# EAGLE design esc_control (EAGLE 9.6.2)
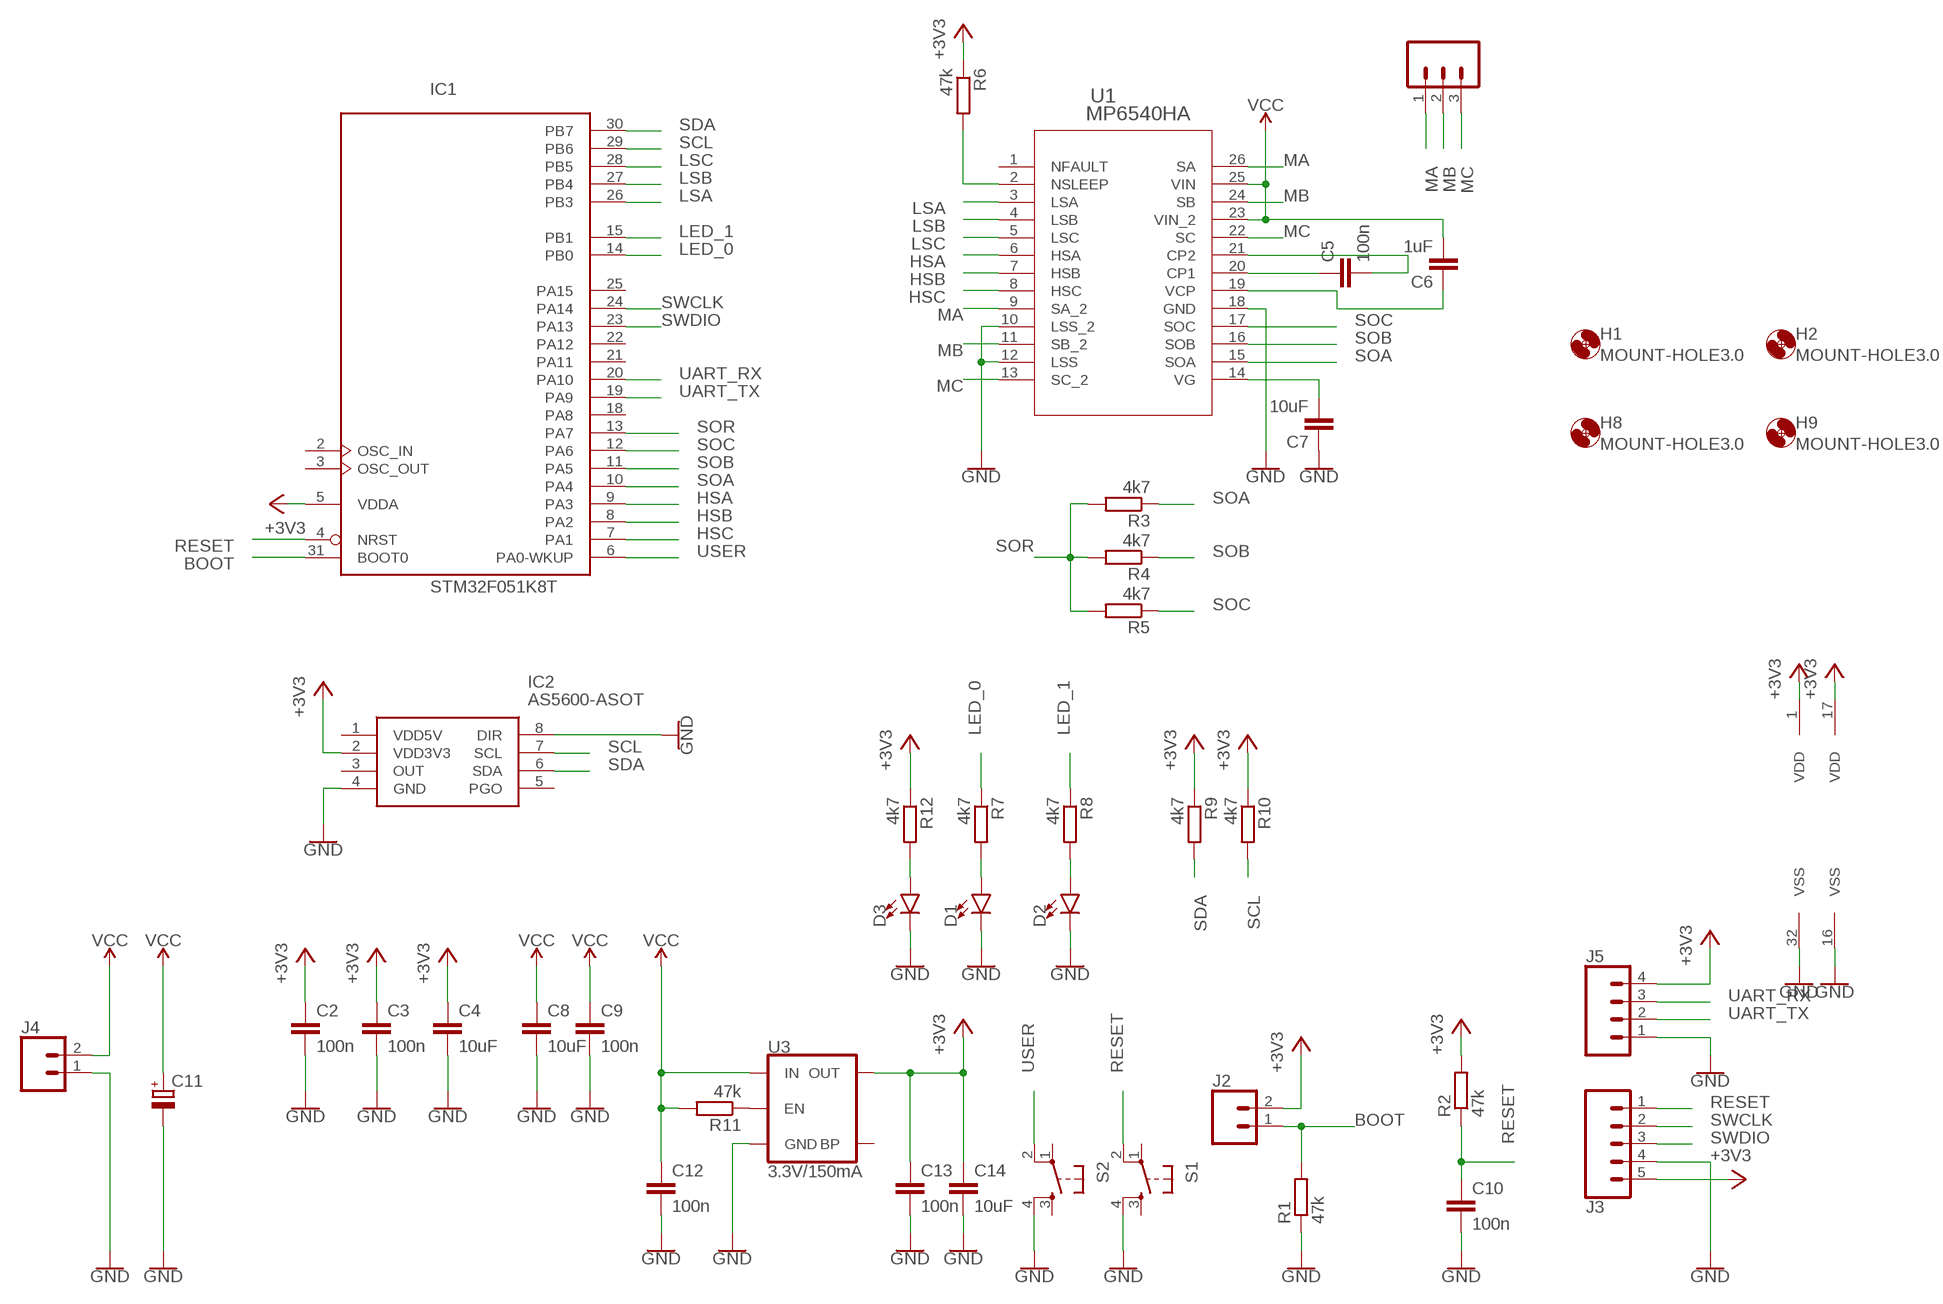
[diagram p0: schematic, sheet 1]

## Parts
C2  100n  C-EUC0805  [C0805]
C3  100n  C-EUC0805  [C0805]
C4  10uF  C-EUC0805  [C0805]
C5  100n  C-EUC0805  [C0805]
C6  1uF  C-EUC0805  [C0805]
C7  10uF  C-EUC0805  [C0805]
C8  10uF  C-EUC0805  [C0805]
C9  100n  C-EUC0805  [C0805]
C10  100n  C-EUC0805  [C0805]
C11  CPOL-EU153CLV-0605  [153CLV-0605]
C12  100n  C-EUC0805  [C0805]
C13  100n  C-EUC0805  [C0805]
C14  10uF  C-EUC0805  [C0805]
D1  LED1206  [LED-1206]
D2  LED1206  [LED-1206]
D3  LED1206  [LED-1206]
H1  MOUNT-HOLE3.0  [3,0]
H2  MOUNT-HOLE3.0  [3,0]
H8  MOUNT-HOLE3.0  [3,0]
H9  MOUNT-HOLE3.0  [3,0]
IC1  STM32F051K8T  [LQFP32]
IC2  AS5600-ASOT  [SOIC127P600X175-8N]
J1  455-1750-1-ND  CONN_03  [1X03]
J2  CONN_02PTH3  [1X02_LONGPADS]
J3  CONN_05PTH_LONGPADS  [1X05_LONGPADS]
J4  CONN_02PTH3  [1X02_LONGPADS]
J5  CONN_04LONGPADS  [1X04_LONGPADS]
R1  47k  R-EU_M0805  [M0805]
R2  47k  R-EU_M0805  [M0805]
R3  4k7  R-EU_M0805  [M0805]
R4  4k7  R-EU_M0805  [M0805]
R5  4k7  R-EU_M0805  [M0805]
R6  47k  R-EU_M0805  [M0805]
R7  4k7  R-EU_M0805  [M0805]
R8  4k7  R-EU_M0805  [M0805]
R9  4k7  R-EU_M0805  [M0805]
R10  4k7  R-EU_M0805  [M0805]
R11  47k  R-EU_M0805  [M0805]
R12  4k7  R-EU_M0805  [M0805]
S1  TAC_SWITCHSMD  [TACTILE-SWITCH-SMD]
S2  TAC_SWITCHSMD  [TACTILE-SWITCH-SMD]
U1  MP6540HA  [QFN-5X5_MP6540HA_MNP]
U3  3.3V/150mA  V_REG_MIC52053.3V  [SOT23-5]

## Nets
+3V3: C2.1 C3.1 C4.1 C13.1 C14.1 IC1.1(VDD) IC1.5(VDDA) IC1.17(VDD) IC2.2(VDD3V3) J2.2 J3.5 J5.4 R2.2 R6.1 R9.1 R10.1 R12.1 U3.5(OUT)
BOOT: IC1.31(BOOT0) J2.1 R1.2
GND: C2.2 C3.2 C4.2 C7.1 C8.2 C9.2 C10.2 C11.- C12.2 C13.2 C14.2 D1.C D2.C D3.C IC1.16(VSS) IC1.32(VSS) IC2.4(GND) IC2.8(DIR) J3.4 J4.1 J5.1 R1.1 S1.4 S2.4 U1.10(LSS_2) U1.12(LSS) U1.18(GND) U3.2(GND)
HSA: IC1.9(PA3) U1.6(HSA)
HSB: IC1.8(PA2) U1.7(HSB)
HSC: IC1.7(PA1) U1.8(HSC)
LED_0: IC1.14(PB0) R7.1
LED_1: IC1.15(PB1) R8.1
LSA: IC1.26(PB3) U1.3(LSA)
LSB: IC1.27(PB4) U1.4(LSB)
LSC: IC1.28(PB5) U1.5(LSC)
MA: J1.1 U1.9(SA_2) U1.26(SA)
MB: J1.2 U1.11(SB_2) U1.24(SB)
MC: J1.3 U1.13(SC_2) U1.22(SC)
N$1: C5.1 U1.20(CP1)
N$2: C5.2 U1.21(CP2)
N$3: C6.1 U1.19(VCP)
N$4: R6.2 U1.2(NSLEEP)
N$5: C7.2 U1.14(VG)
N$6: D1.A R7.2
N$7: D2.A R8.2
N$8: R11.1 U3.3(EN)
N$9: D3.A R12.2
RESET: C10.1 IC1.4(NRST) J3.1 R2.1 S1.2
SCL: IC1.29(PB6) IC2.7(SCL) R10.2
SDA: IC1.30(PB7) IC2.6(SDA) R9.2
SOA: IC1.10(PA4) R3.1 U1.15(SOA)
SOB: IC1.11(PA5) R4.1 U1.16(SOB)
SOC: IC1.12(PA6) R5.1 U1.17(SOC)
SOR: IC1.13(PA7) R3.2 R4.2 R5.2
SWCLK: IC1.24(PA14) J3.2
SWDIO: IC1.23(PA13) J3.3
UART_RX: IC1.20(PA10) J5.3
UART_TX: IC1.19(PA9) J5.2
USER: IC1.6(PA0-WKUP) S2.2
VCC: C6.2 C8.1 C9.1 C11.+ C12.1 J4.2 R11.2 U1.23(VIN_2) U1.25(VIN) U3.1(IN)
Unconnected: IC1.2(OSC_IN) IC1.3(OSC_OUT) IC1.18(PA8) IC1.21(PA11) IC1.22(PA12) IC1.25(PA15) IC2.1(VDD5V) IC2.3(OUT) IC2.5(PGO) S1.1 S1.3 S2.1 S2.3 U1.1(NFAULT) U3.4(BP)

## Library data of the parts
C2-C10 C12-C14 = rcl:C-EU: CAPACITOR, European symbol; SPICEPREFIX: C
C11 = rcl:CPOL-EU: POLARIZED CAPACITOR, European symbol; SPICEPREFIX: C
D1-D3 = SparkFun-LED:LED: LED (Generic) Standard schematic elements and footprints for 5mm, 3mm, 1206, and 0603 sized LEDs. Generic LEDs with no color specified.
H1 H2 H8 H9 = holes:MOUNT-HOLE: MOUNTING HOLE with drill center marker
IC1 = micro-stm_v3:STM32F051K*T: ARM 32-bit Cortex™-M0 CPU 48 MHz maximum frequency 16 to 32 Kbytes of Flash memory 4 kbytes of SRAM 25 GPIOs 2.0 to 3.6 V application supply
IC2 = AS5600:AS5600-ASOT: Board Mount Hall Effect / Magnetic Sensors AS5600 Magnetic Sensor 12-Bit Source: Datasheet <http://www.ams.com/eng/content/download/639463/1698857/325295>; DESCRIPTION: Board Mount Hall Effect / Magnetic Sensors AS5600 Magnetic Sensor 12-Bit; HEIGHT: 1.75mm; MANUFACTURER_NAME: ams; MANUFACTURER_PART_NUMBER: AS5600-ASOT; MOUSER_PART_NUMBER: 985-AS5600-ASOT; MOUSER_PRICE-STOCK: https://www.mouser.com/Search/Refine.aspx?Keyword=985-AS5600-ASOT
J1 = SparkFun-Connectors:CONN_03: Multi connection point. Often used as Generic Header-pin footprint for 0.1 inch spaced/style header connections On any of the 0.1 inch spaced packages, you can populate with these: Break Away Headers - Straight <https://www.sparkfun.com/products/116> (PRT-00116) Break Away Male Headers - Right Angle <https://www.sparkfun.com/products/553> (PRT-00553) Female Headers <https://www.sparkfun.com/products/115> (PRT-00115) Break Away Headers - Machine Pin <https://www.sparkfun.com/products/117> (PRT-00117) Break Away Female Headers - Swiss Machine Pin <https://www.sparkfun.com/products/743> (PRT-00743) Stackable Header - 3 Pin (Female, 0.1") <https://www.sparkfun.com/products/13875> (PRT-13875) For SCREWTERMINALS and SPRING TERMINALS visit here: Screw Terimnals on SparkFun.com <https://www.sparkfun.com/search/results?term=Screw+Terminals> (5mm/3.5mm/2.54mm spacing) This device is also useful as a general connection point to wire up your design to another part of your project. Our various solder wires solder well into these plated through hole pads. Hook-Up Wire - Assortment (Stranded, 22 AWG) <https://www.sparkfun.com/products/11375> (PRT-11375) Hook-Up Wire - Assortment (Solid Core, 22 AWG) <https://www.sparkfun.com/products/11367> (PRT-11367) View the entire wire category on our website here <https://www.sparkfun.com/categories/141> Special notes: Molex polarized connector foot print use with SKU : PRT-08232 with associated crimp pins and housings.; PROD_ID: XXX-00000
J2 J4 = SparkFun-Connectors:CONN_02: Multi connection point. Often used as Generic Header-pin footprint for 0.1 inch spaced/style header connections On any of the 0.1 inch spaced packages, you can populate with these: Break Away Headers - Straight <https://www.sparkfun.com/products/116> (PRT-00116) Break Away Male Headers - Right Angle <https://www.sparkfun.com/products/553> (PRT-00553) Female Headers <https://www.sparkfun.com/products/115> (PRT-00115) Break Away Headers - Machine Pin <https://www.sparkfun.com/products/117> (PRT-00117) Break Away Female Headers - Swiss Machine Pin <https://www.sparkfun.com/products/743> (PRT-00743) For SCREWTERMINALS and SPRING TERMINALS visit here: Screw Terimnals on SparkFun.com <https://www.sparkfun.com/search/results?term=Screw+Terminals> (5mm/3.5mm/2.54mm spacing) This device is also useful as a general connection point to wire up your design to another part of your project. Our various solder wires solder well into these plated through hole pads. Hook-Up Wire - Assortment (Stranded, 22 AWG) <https://www.sparkfun.com/products/11375> (PRT-11375) Hook-Up Wire - Assortment (Solid Core, 22 AWG) <https://www.sparkfun.com/products/11367> (PRT-11367) View the entire wire category on our website here <https://www.sparkfun.com/categories/141> Special notes: Molex polarized connector foot print use with: PRT-08233 with associated crimp pins and housings. 2.54_SCREWTERM for use with PRT-10571. 3.5mm Screw Terminal footprints for PRT-08084 5mm Screw Terminal footprints for use with PRT-08432
J3 = SparkFun-Connectors:CONN_05: Multi connection point. Often used as Generic Header-pin footprint for 0.1 inch spaced/style header connections On any of the 0.1 inch spaced packages, you can populate with these: Break Away Headers - Straight <https://www.sparkfun.com/products/116> (PRT-00116) Break Away Male Headers - Right Angle <https://www.sparkfun.com/products/553> (PRT-00553) Female Headers <https://www.sparkfun.com/products/115> (PRT-00115) Break Away Headers - Machine Pin <https://www.sparkfun.com/products/117> (PRT-00117) Break Away Female Headers - Swiss Machine Pin <https://www.sparkfun.com/products/743> (PRT-00743) For SCREWTERMINALS and SPRING TERMINALS visit here: Screw Terimnals on SparkFun.com <https://www.sparkfun.com/search/results?term=Screw+Terminals> (5mm/3.5mm/2.54mm spacing) This device is also useful as a general connection point to wire up your design to another part of your project. Our various solder wires solder well into these plated through hole pads. Hook-Up Wire - Assortment (Stranded, 22 AWG) <https://www.sparkfun.com/products/11375> (PRT-11375) Hook-Up Wire - Assortment (Solid Core, 22 AWG) <https://www.sparkfun.com/products/11367> (PRT-11367) View the entire wire category on our website here <https://www.sparkfun.com/categories/141> Special notes: Molex polarized connector foot print use with SKU : PRT-08231 with associated crimp pins and housings. 1MM SMD Version SKU: PRT-10208
J5 = SparkFun-Connectors:CONN_04: Multi connection point. Often used as Generic Header-pin footprint for 0.1 inch spaced/style header connections On any of the 0.1 inch spaced packages, you can populate with these: Break Away Headers - Straight <https://www.sparkfun.com/products/116> (PRT-00116) Break Away Male Headers - Right Angle <https://www.sparkfun.com/products/553> (PRT-00553) Female Headers <https://www.sparkfun.com/products/115> (PRT-00115) Break Away Headers - Machine Pin <https://www.sparkfun.com/products/117> (PRT-00117) Break Away Female Headers - Swiss Machine Pin <https://www.sparkfun.com/products/743> (PRT-00743) For SCREWTERMINALS and SPRING TERMINALS visit here: Screw Terimnals on SparkFun.com <https://www.sparkfun.com/search/results?term=Screw+Terminals> (5mm/3.5mm/2.54mm spacing) This device is also useful as a general connection point to wire up your design to another part of your project. Our various solder wires solder well into these plated through hole pads. Hook-Up Wire - Assortment (Stranded, 22 AWG) <https://www.sparkfun.com/products/11375> (PRT-11375) Hook-Up Wire - Assortment (Solid Core, 22 AWG) <https://www.sparkfun.com/products/11367> (PRT-11367) View the entire wire category on our website here <https://www.sparkfun.com/categories/141> Special notes: Molex polarized connector foot print use with SKU : PRT-08231 with associated crimp pins and housings. 1MM SMD Version SKU: PRT-10208; PROD_ID: CONN-09696
R1-R12 = rcl:R-EU_: RESISTOR, European symbol; SPICEPREFIX: R
S1 S2 = SparkFun-Retired:TAC_SWITCH: Momentary Switch Button commonly used for reset or general input. Spark Fun Electronics SKU : COM-00097 SMT- SWCH-08247; PROD_ID: SWCH-08247
U1 = my_library:MP6540HA; BUILT_BY: EMA_Justin; COPYRIGHT: Copyright (C) 2018 Accelerated Designs. All rights reserved; DATASHEET: https://www.monolithicpower.com/en/documentview/productdocument/index/version/2/document_type/Datasheet/lang/en/sku/MP6540HA/document_id/6884/; MANUFACTURER_PART_NUMBER: MP6540HA; SOURCELIBRARY: Monolithic_Power_Systems_2020-10-09; VENDOR: Monolithic Power Systems Inc
U3 = SparkFun-IC-Power:V_REG_MIC5205: V_REG MIC5205 Standard 3.3V, 5V, and Adjustable 150mA LDO voltage regulator in SOT-23 layout. Micrel part MIC5205. BP (by-pass) pin is used to lower output noise with 470pF cap, may be left open. On the adjustable version BP is used to set output.; PROD_ID: VREG-00822

## Board
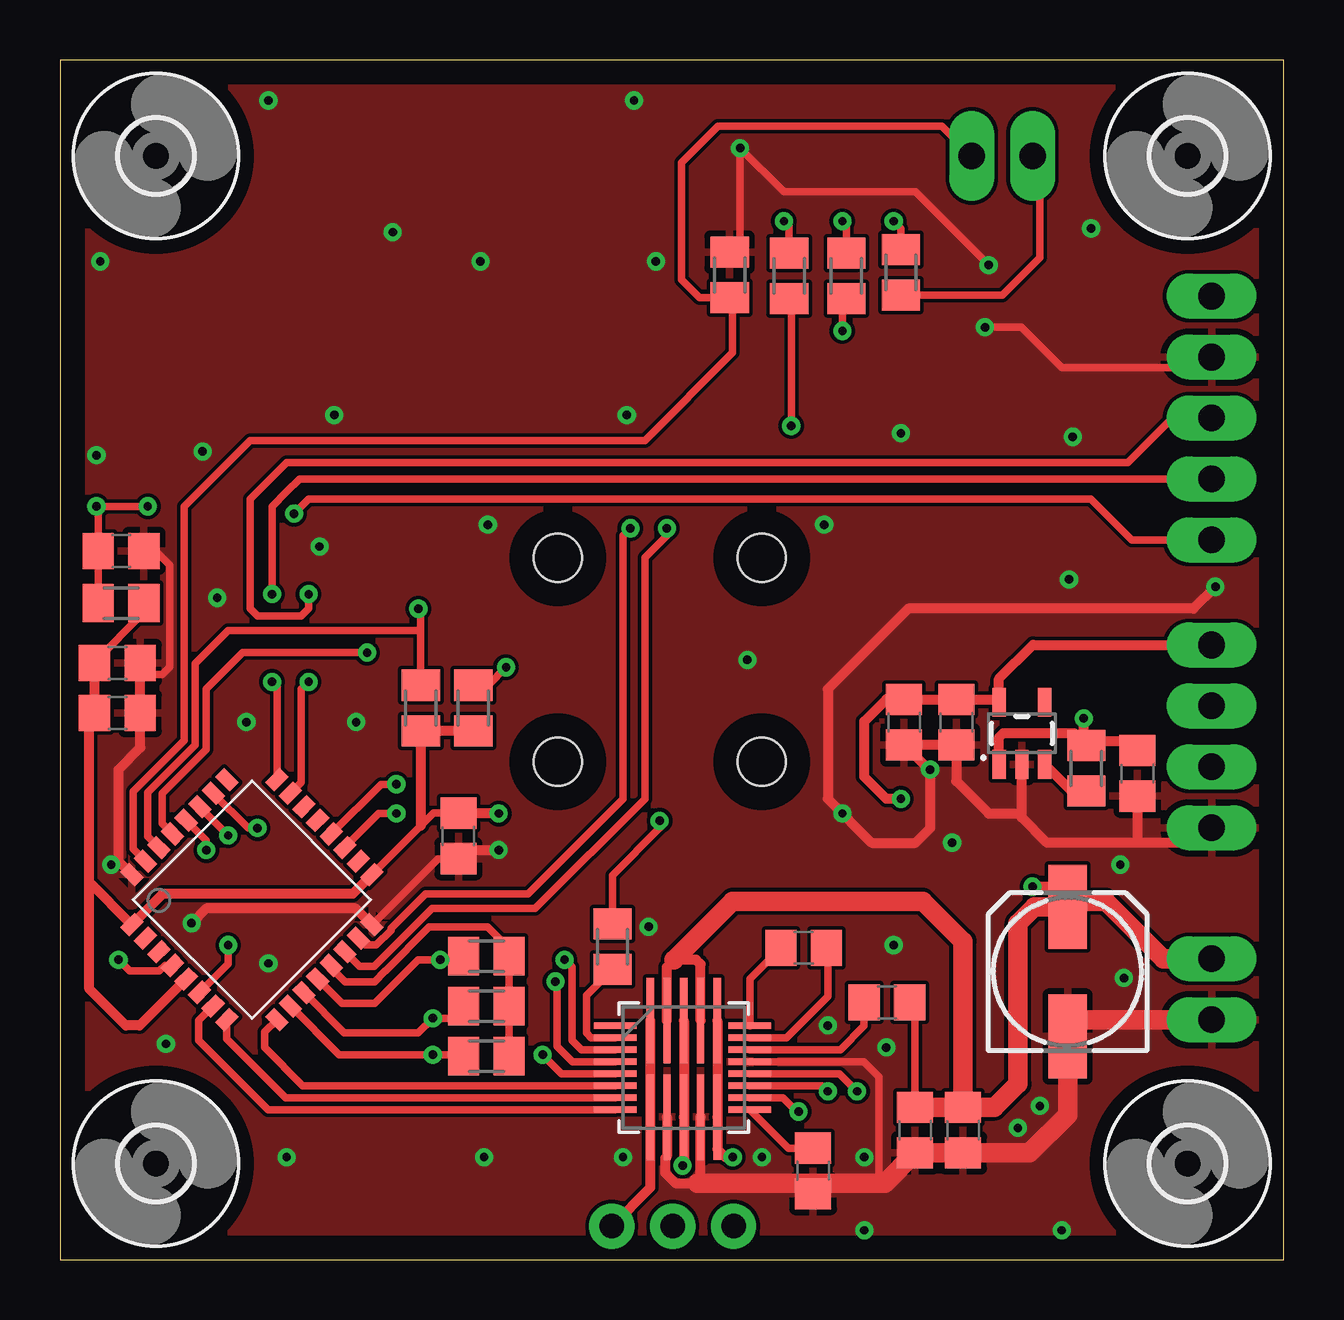
[diagram p1: board, top side]
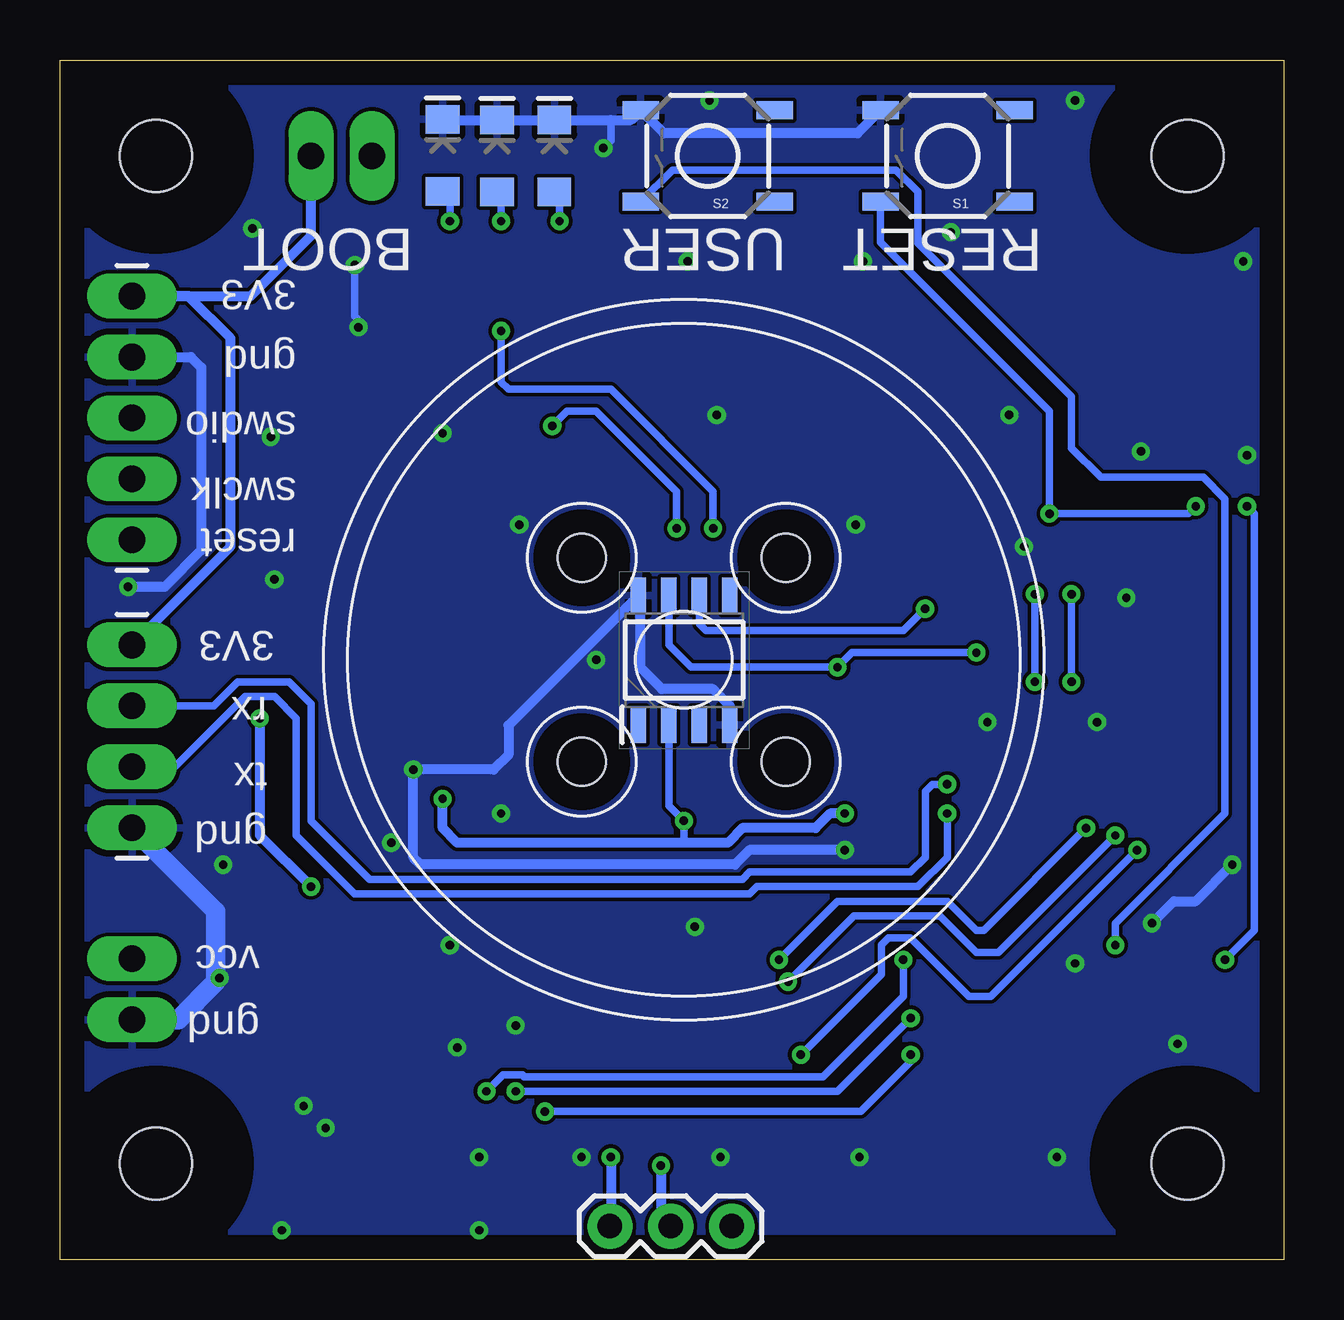
[diagram p2: board, bottom side, seen from below]

Size 51 x 50 mm. Coordinates in mm from the lower left corner, seen from the top.
Outline: 0,0 51,0 51,50 0,50 0,0
Copper layers (1*16): Top 0.035mm / dielectric 1.5mm / Bottom 0.035mm
Design rules "default": minimum track width 6mil, minimum drill 0.35mm, track to track 6mil, track to pad 6mil, pad to pad 6mil, via to via 6mil, smd to smd 6mil, copper to edge 40mil, drill to drill 6mil, minimum pad ring 10mil, minimum via ring 8mil, stop-mask expansion 4mil, vias tented up to drill 0mil, thermal gap 10mil

### Footprints (pad centres in the part's own frame; a part is rotated, then mirrored left to right if it is on the bottom)
C0805 = smd 1.3 x 1.5: 1 -0.95,0; 2 0.95,0
153CLV-0605 = smd 3.5 x 1.6: + 2.7,0; - -2.7,0
LED-1206 = smd 1.2 x 1.4: A -1.5,0; C 1.5,0
3,0 = hole 3: 0,0
LQFP32 = smd 0.54 x 0.85: 1 -2.8,-4.275; 2 -2,-4.275; 3 -1.2,-4.275; 4 -0.4,-4.275; 5 0.4,-4.275; 6 1.19,-4.275; 7 1.99,-4.275; 8 2.79,-4.275; 17 2.8,4.275; 18 2,4.275; 19 1.2,4.275; 20 0.4,4.275; 21 -0.4,4.275; 22 -1.2,4.275; 23 -2,4.275; 24 -2.8,4.275 | smd 0.85 x 0.54: 9 4.275,-2.8; 10 4.275,-2; 11 4.275,-1.2; 12 4.275,-0.4; 13 4.275,0.4; 14 4.275,1.2; 15 4.275,2; 16 4.275,2.8; 25 -4.275,2.8; 26 -4.275,2; 27 -4.275,1.2; 28 -4.275,0.4; 29 -4.275,-0.4; 30 -4.275,-1.2; 31 -4.275,-2; 32 -4.275,-2.8
SOIC127P600X175-8N = smd 1.5 x 0.65: 1 -2.7,1.905; 2 -2.7,0.635; 3 -2.7,-0.635; 4 -2.7,-1.905; 5 2.7,-1.905; 6 2.7,-0.635; 7 2.7,0.635; 8 2.7,1.905
1X03 = drill 1.016 pad 1.88: 1 0,0; 2 2.54,0; 3 5.08,0
1X02_LONGPADS = drill 1.118 pad 1.88 long: 1 0,0; 2 2.54,0
1X05_LONGPADS = drill 1.118 pad 1.88 long: 1 0,0; 2 2.54,0; 3 5.08,0; 4 7.62,0; 5 10.16,0
1X04_LONGPADS = drill 1.118 pad 1.88 long: 1 0,0; 2 2.54,0; 3 5.08,0; 4 7.62,0
M0805 = smd 1.3 x 1.6: 1 -0.95,0; 2 0.95,0
TACTILE-SWITCH-SMD = smd 1.524 x 0.762: 1 -2.794,1.905; 2 2.794,1.905; 3 -2.794,-1.905; 4 2.794,-1.905
QFN-5X5_MP6540HA_MNP = smd 1.778 x 0.254: 1 -2.858,1.75; 2 -2.858,1.25; 3 -2.858,0.75; 4 -2.858,0.25; 5 -2.858,-0.25; 6 -2.858,-0.75; 7 -2.858,-1.25; 8 -2.858,-1.75; 14 2.756,-1.75; 15 2.756,-1.25; 16 2.756,-0.75; 17 2.756,-0.25; 18 2.756,0.25; 19 2.756,0.75; 20 2.756,1.25; 21 2.756,1.75 | smd 0.305 x 3.556: 9 -1.4,-2.058; 10 -0.7,-2.058; 11 0,-2.058; 12 0.7,-2.058; 13 1.4,-2.058; 22 1.4,1.956; 23 0.7,1.956; 24 0,1.956; 25 -0.7,1.956; 26 -1.4,1.956
SOT23-5 = smd 0.55 x 1.2: 1 -0.95,-1.3; 2 0,-1.3; 3 0.95,-1.3; 4 0.95,1.3; 5 -0.95,1.3
BRUSHLESS_GIMBAL_MOTOR_2204 = hole 2: 4.25,4.25; -4.25,4.25; -4.25,-4.25; 4.25,-4.25

### Placement (x,y rotation side)
C2  2.39,24.87 0 top
C3  16.61,17.66 270 top
C4  2.39,22.78 0 top
C5  31,13 180 top
C6  34.47,10.72 0 top
C7  31.39,3.7 90 top
C8  35.64,5.39 270 top
C9  37.64,5.39 270 top
C10  2.55,29.53 0 top
C11  42,12 90 top
C12  44.91,20.26 270 top
C13  35.18,22.4 270 top
C14  37.36,22.4 270 top
D1  30.39,46 90 bottom
D2  32.78,46 90 bottom
D3  35.05,46.02 90 bottom
H1  47,4 0 top
H2  47,46 0 top
H8  4,4 0 top
H9  4,46 0 top
IC1  8,15 315 top
IC2  24.99,24.99 90 bottom
J1  23,1.39 180 bottom
J2  38,46 180 bottom
J3  48,30 90 bottom
J4  48,10 90 bottom
J5  48,18 90 bottom
R1  27.91,41.04 270 top
R2  2.55,27.36 0 top
R3  17.77,8.48 0 top
R4  17.77,10.56 0 top
R5  17.77,12.65 0 top
R6  23.03,13.04 270 top
R7  30.39,41 90 top
R8  32.78,41 90 top
R9  15.04,22.99 90 top
R10  17.22,22.99 90 top
R11  42.78,20.48 90 top
R12  35.05,41.15 90 top
S1  14,46 180 bottom
S2  24,46 180 bottom
U1  26,8 0 top
U3  40.09,21.93 0 top
U$1  [BRUSHLESS_GIMBAL_MOTOR_2204]  25,25 0 bottom

### Tracks (layer width: path | path; a pad name or v marks a point on that pad's centre or on a via)
+3V3  (via drill 0.35)
  Top 0.305: C3.1 15.57,18.61 15.04,18.08 IC1.17 | 22.86,14.16 R6.1 23.03,16.02 24.99,17.98 v24.99,18.29 | C2.1 1.44,24.91 3.5,26.97 R2.2 | R12.1 39.28,40.2 40.84,41.76 40.84,45.7 J2.2
  Top 0.406: J5.4 40.55,25.62 39.14,24.21 U3.5 39.03,23.35 C14.1 C13.1 34.44,23.35 33.53,22.43 33.53,20.12 34.44,19.2 v35.05,19.2 | 1.22,15.73 IC1.1 4.28,15.24 12.2,15.24 IC1.17 | 1.22,15.73 1.22,22.56 C4.1 C2.1 | IC1.5 3.32,9.75 2.74,9.75 1.22,11.28 1.22,15.73 | R10.1 R9.1 15.04,18.08 | C3.1 18.27,18.61 v18.29,18.59
  Bottom 0.305: 24.99,17.37 v24.99,18.29 25.62,18.92 IC2.2
  Bottom 0.406: v18.29,18.59 18.9,18.59 19.51,17.98 22.55,17.98 23.16,17.37 24.99,17.37 34.44,17.37 35.05,17.98 v35.05,19.2 | J2.2 40.54,42.67 43.05,40.16 J3.5 45.65,40.16 43.89,38.41 43.89,29.73 J5.4
BOOT
  Top 0.305: IC1.31 3.05,17.12 3.05,19.51 5.18,21.64 5.18,31.39 7.92,34.14 24.38,34.14 28.04,37.8 28.04,39.96 R1.2 26.66,40.09 25.91,40.84 25.91,45.72 27.43,47.24 36.76,47.24 J2.1
GND  (via drill 0.35)
  Top 0.305: C7.1 31.39,3.18 | 33.83,3.18 34.14,3.49 34.14,7.62 33.51,8.25 U1.18 | IC1.16 15.75,16.71 C3.2 | C10.2 3.99,29.53 4.57,28.96 4.57,24.69 4.27,24.38 3.34,24.38 | R1.1 28.35,42.42 v28.35,46.33 30.18,44.5 35.66,44.5 v38.71,41.45 | v38.56,38.86 40.08,38.86 41.76,37.19 47.57,37.19 J3.4
  Top 0.406: U1.10 25.3,4.3 25.22,4.22 25.22,3.61 25.65,3.18 26.56,3.18 26.69,3.31 26.69,5.93 U1.12 | C9.2 C8.2 | J5.1 47.37,17.37 44.81,17.37 | 44.81,17.37 41.14,17.37 40.09,18.42 40.09,18.59 | 40.09,18.59 U3.2 | 40.09,18.59 38.71,18.59 37.36,19.94 C14.2 C13.2 36.21,20.42 | C12.2 44.91,17.48 44.81,17.37 | IC1.32 2.44,16.6 2.44,16.76 | 2.44,16.76 2.44,20.42 3.35,21.34 3.35,22.77 C4.2 3.34,24.38 C2.2 | IC1.16 12.33,14.63 6.1,14.63 v5.49,14.02 | v2.13,16.46 2.44,16.76 | 36.21,20.42 v36.27,20.42 | C3.2 16.97,17.07 v18.29,17.07 | v48.16,28.04 47.24,27.13 35.36,27.13 32,23.77 32,19.2 33.83,17.37 35.66,17.37 36.27,17.98 36.27,20.36 36.21,20.42
  Top 0.813: 26.56,3.18 31.39,3.18 33.83,3.18 34.38,3.18 C8.2 40.41,4.44 42,6.03 C11.- 42.7,10 J4.1
  Bottom 0.305: v28.35,46.33 28.04,46.63 28.04,47.5 | v38.71,41.45 38.71,39.32 38.41,39.01 v38.56,38.86
  Bottom 0.406: v5.49,14.02 4.57,14.94 3.66,14.94 v2.13,16.46 | IC2.4 23.08,23.08 23.77,23.77 25.91,23.77 26.82,24.69 26.82,27.62 IC2.8 32.31,22.27 32.31,21.03 32.92,20.42 v36.27,20.42 36.27,16.76 35.97,16.46 22.86,16.46 22.25,17.07 v18.29,17.07 | D3.C 35.03,47.5 D2.C D1.C 28.04,47.5 27.2,47.5 S2.4 25.83,46.94 17.76,46.94 S1.4 | J3.4 45.55,37.62 45.11,37.19 45.11,29.57 46.63,28.04 v48.16,28.04
  Bottom 0.813: J5.1 44.5,14.5 44.5,11.58 46.08,10 J4.1
  other vias: 33.53,4.27 29.26,4.27 39.93,5.49 40.84,6.4 34.44,8.84 32,9.75 34.75,13.11 23.47,4.27 33.53,1.22 41.76,1.22 44.2,16.46 17.68,4.27 9.45,4.27 37.19,17.37 42.21,34.29 23.62,35.2 11.43,35.2 17.53,41.61 24.84,41.61 13.87,42.82 1.68,41.61 5.94,33.68 8.69,48.31 23.93,48.31 31.85,30.63 17.83,30.63 6.55,27.58 7.77,22.4 12.34,22.4 8.69,12.34 4.42,8.99 24.54,13.87 44.35,11.73 32.61,18.59 28.65,24.99 42.06,28.35 35.05,34.44 42.98,42.98 1.52,33.53 10.82,29.72
  pour Top: -0.61,50.6 51.51,50.6 51.51,-2.74 -0.61,-2.74
  pour Bottom: -0.3,51.82 75.29,51.82 75.29,-2.13 -0.3,-2.13
HSA
  Top 0.305: U1.6 10.12,7.25 8.53,8.84 8.53,9.49 IC1.9
HSB
  Top 0.305: U1.7 9.4,6.75 6.95,9.2 IC1.8
HSC
  Top 0.305: U1.8 8.69,6.25 5.79,9.14 5.79,9.98 IC1.7
LED_0  (via drill 0.35)
  Top 0.305: IC1.14 12.49,12.21 13.09,12.21 15.51,14.63 19.81,14.63 24.38,19.2 24.38,29.26 25.3,30.18 v25.3,30.48 | v30.48,34.75 30.48,39.96 R7.1
  Bottom 0.305: v25.3,30.48 25.3,32 28.65,35.36 29.87,35.36 v30.48,34.75
LED_1  (via drill 0.35)
  Top 0.305: IC1.15 12.72,13.11 13.18,13.11 13.8,13.72 13.8,13.8 15.24,15.24 19.51,15.24 23.47,19.2 23.47,30.18 v23.77,30.48 | v32.61,38.71 32.61,39.88 R8.1
  Bottom 0.305: v23.77,30.48 23.77,32 28.04,36.27 32.31,36.27 32.61,36.58 v32.61,38.71
LSA  (via drill 0.35)
  Top 0.305: U1.3 21.73,8.75 21.34,9.14 21.34,12.19 v21.03,12.5 | v8.23,17.98 7.84,17.98 IC1.26
  Bottom 0.305: v21.03,12.5 18.59,14.94 14.02,14.94 12.8,13.72 12.5,13.72 v8.23,17.98
LSB  (via drill 0.35)
  Top 0.305: U1.4 21.37,8.25 20.73,8.89 20.73,11.51 v20.65,11.58 | v7.01,17.68 IC1.27
  Bottom 0.305: v20.65,11.58 17.91,14.33 14.33,14.33 12.8,12.8 11.89,12.8 v7.01,17.68
LSC  (via drill 0.35)
  Top 0.305: U1.5 20.9,7.75 v20.12,8.53 | IC1.28 6.1,17.47 v6.1,17.07
  Bottom 0.305: v6.1,17.07 10.67,12.5 10.97,12.19 12.19,10.97 13.11,10.97 15.54,13.41 16.46,13.41 16.76,13.11 16.76,11.89 v20.12,8.53
MA
  Top 0.406: U1.26 U1.9 24.6,2.99 J1.1
MB  (via drill 0.35)
  Top 0.406: U1.24 U1.11 26,4.05 25.91,3.96 v25.95,3.92
  Bottom 0.406: v25.95,3.92 25.95,1.8 J1.2
MC  (via drill 0.35)
  Top 0.406: U1.22 U1.13 27.4,4.6 27.74,4.27 v28.04,4.27
  Bottom 0.406: v28.04,4.27 28.04,1.43 J1.3
N$1
  Top 0.305: U1.20 30.28,9.25 32,10.97 32,12.95 C5.1
N$2
  Top 0.305: U1.21 28.76,11.71 C5.2
N$3
  Top 0.305: U1.19 32.52,8.75 33.52,9.74 C6.1
N$4
  Top 0.305: U1.2 22.14,9.25 21.95,9.45 21.95,11.01 R6.2
N$5
  Top 0.305: U1.14 30.36,4.64 C7.2
N$6  (via drill 0.35)
  Top 0.305: R7.2 30.39,43.07 v30.18,43.28
  Bottom 0.305: v30.18,43.28 30.18,44.28 D1.A
N$7  (via drill 0.35)
  Top 0.305: R8.2 32.78,43.11 v32.61,43.28
  Bottom 0.305: v32.61,43.28 32.61,44.33 D2.A
N$8
  Top 0.406: U3.3 42.15,19.53 R11.1
N$9  (via drill 0.35)
  Top 0.305: R12.2 35.05,42.98 v34.75,43.28
  Bottom 0.305: v34.75,43.28 34.75,44.22 D3.A
RESET  (via drill 0.35)
  Top 0.305: J3.1 44.68,30 42.98,31.7 10.36,31.7 v9.75,31.09 | IC1.4 4.38,12.26 4.14,12.03 2.91,12.03 v2.44,12.5 | R2.1 C10.1 1.6,31.32 v1.52,31.39 v3.66,31.39
  Bottom 0.305: v2.44,12.5 1.22,13.72 1.22,31.09 v1.52,31.39 | v3.66,31.39 3.96,31.09 v9.75,31.09 9.75,35.36 16.79,42.4 S1.2
SCL  (via drill 0.35)
  Top 0.305: IC1.29 4.27,18.17 4.27,19.43 6.1,21.26 6.1,23.77 7.62,25.3 v12.8,25.3 | v18.59,24.69 17.84,23.94 R10.2
  Bottom 0.305: IC2.7 25.62,25.62 24.69,24.69 v18.59,24.69 17.98,25.3 v12.8,25.3
SDA  (via drill 0.35)
  Top 0.305: IC1.30 3.66,17.64 3.66,19.47 5.64,21.45 5.64,24.84 7.01,26.21 15.04,26.21 | v14.94,27.13 15.04,27.02 15.04,26.21 | 15.04,26.21 R9.2
  Bottom 0.305: IC2.6 24.35,26.49 24.08,26.21 23.16,26.21 15.85,26.21 v14.94,27.13
SOA  (via drill 0.35)
  Top 0.305: U1.15 30.13,6.75 30.79,6.1 v30.79,6.17 | R3.1 16.77,8.53 v15.54,8.53 11.64,8.53 IC1.10
  Bottom 0.305: v30.79,6.17 17.61,6.17 15.54,8.23 v15.54,8.53
SOB  (via drill 0.35)
  Top 0.305: U1.16 31.76,7.25 v32,7.01 | R4.1 16.32,10.06 v15.54,10.06 14.94,9.45 11.85,9.45 IC1.11
  Bottom 0.305: v32,7.01 18.59,7.01 v15.54,10.06
SOC  (via drill 0.35)
  Top 0.305: U1.17 32.48,7.75 v33.22,7.01 | R5.1 16.67,12.5 v15.85,12.5 14.94,12.5 13.11,10.67 11.77,10.67 IC1.12
  Bottom 0.305: v33.22,7.01 32.54,7.69 31.72,7.69 31.65,7.62 19.2,7.62 15.85,10.97 v15.85,12.5
SOR
  Top 0.305: 18.88,12.5 R5.2 | R5.2 R4.2 R3.2 | R5.2 18.72,12.97 17.83,13.87 15.39,13.87 13.56,12.04 13.55,12.03 13.11,11.58 11.89,11.58 11.31,12.16 IC1.13
SWCLK  (via drill 0.35)
  Top 0.305: IC1.24 9.04,23.88 v8.84,24.08 | v8.84,27.74 8.84,31.39 9.45,32 9.98,32.54 J3.2
  Bottom 0.305: v8.84,24.08 v8.84,27.74
SWDIO  (via drill 0.35)
  Top 0.305: IC1.23 10.06,19.89 10.06,23.77 v10.36,24.08 | J3.3 46.36,35.08 44.5,33.22 9.45,33.22 7.92,31.7 7.92,27.13 8.23,26.82 10.06,26.82 10.36,27.13 v10.36,27.74
  Bottom 0.305: v10.36,24.08 v10.36,27.74
UART_RX  (via drill 0.35)
  Top 0.305: IC1.20 13.38,19.81 v14.02,19.81
  Bottom 0.305: J5.3 44.59,23.08 43.59,24.08 41.45,24.08 40.54,23.16 40.54,18.29 39.01,16.76 38.71,16.46 38.1,15.85 22.55,15.85 22.25,16.15 15.54,16.15 14.94,16.76 14.94,19.51 14.63,19.81 v14.02,19.81
UART_TX  (via drill 0.35)
  Top 0.305: IC1.19 13.29,18.59 v14.02,18.59
  Bottom 0.305: J5.2 46.21,20.54 43.28,23.47 42.06,23.47 41.15,22.55 41.15,17.68 38.71,15.24 25.91,15.24 25.6,15.24 22.25,15.24 21.95,15.54 15.24,15.54 14.02,16.76 v14.02,18.59
USER  (via drill 0.35)
  Top 0.305: IC1.6 7.01,12.33 v7.01,13.11
  Bottom 0.305: v7.01,13.11 7.01,14.02 2.44,18.59 2.44,31.7 3.35,32.61 7.62,32.61 8.84,33.83 8.84,35.97 15.24,42.37 15.24,44.5 16.15,45.41 25.47,45.41 S2.2
VCC  (via drill 0.35)
  Top 0.305: C8.1 35.64,10.5 C6.2
  Top 0.406: U1.25 25.3,12.19 25.6,12.5 26.52,12.5 26.7,12.31 U1.23 | C9.1 C8.1 | U3.1 39.14,21.77 39.32,21.95 42.26,21.95 42.62,21.59 | 42.62,21.59 R11.2 42.67,21.54 v42.67,22.55 | C12.1 44.53,21.59 42.62,21.59 | v40.54,15.54 41.16,15.54 C11.+
  Top 0.813: C8.1 38.96,6.34 39.93,7.32 39.93,14.02 40.61,14.7 C11.+ 42.23,14.94 43.59,14.94 45.98,12.54 J4.2 | C9.1 37.64,13.26 35.97,14.94 28.04,14.94 25.6,12.5
  Bottom 0.406: v42.67,22.55 42.67,17.68 v40.54,15.54

### Text on the board
bNames: RESET | USER | BOOT | 3V3 | gnd | swdio | swclk | reset | 3V3 | rx | tx | gnd | vcc | gnd